# Altium project tag201TestFixture.PrjPCB
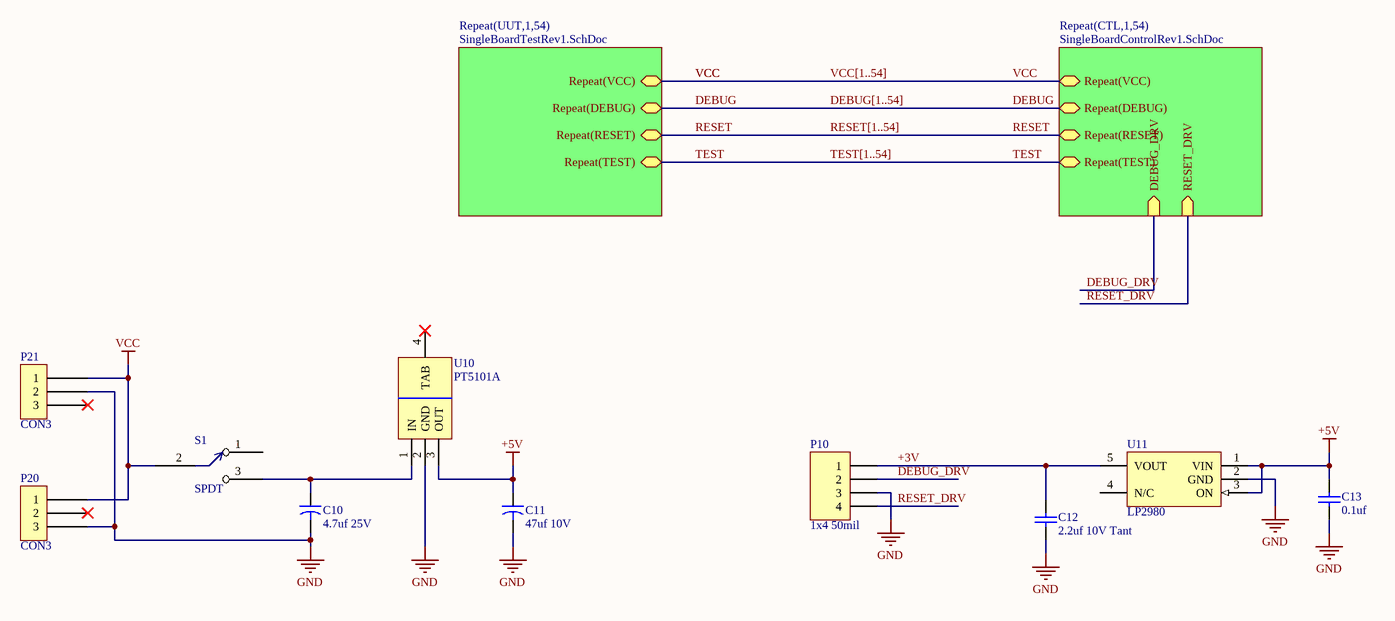
[diagram p0: Tag201_GangProgrammerColumnRev1.SchDoc]
3 sheets, 874 parts. Net scope: hierarchical (ports join the sheet entries above them; power ports are global).
Board file: Tag201_GangProgrammerRev1.PcbDoc
Sheets:
  Tag201_GangProgrammerColumnRev1.SchDoc
    UUT1 = SingleBoardTestRev1.SchDoc
    UUT2 = SingleBoardTestRev1.SchDoc
    UUT3 = SingleBoardTestRev1.SchDoc
    UUT4 = SingleBoardTestRev1.SchDoc
    UUT5 = SingleBoardTestRev1.SchDoc
    UUT6 = SingleBoardTestRev1.SchDoc
    UUT7 = SingleBoardTestRev1.SchDoc
    UUT8 = SingleBoardTestRev1.SchDoc
    UUT9 = SingleBoardTestRev1.SchDoc
    UUT10 = SingleBoardTestRev1.SchDoc
    UUT11 = SingleBoardTestRev1.SchDoc
    UUT12 = SingleBoardTestRev1.SchDoc
    UUT13 = SingleBoardTestRev1.SchDoc
    UUT14 = SingleBoardTestRev1.SchDoc
    UUT15 = SingleBoardTestRev1.SchDoc
    UUT16 = SingleBoardTestRev1.SchDoc
    UUT17 = SingleBoardTestRev1.SchDoc
    UUT18 = SingleBoardTestRev1.SchDoc
    UUT19 = SingleBoardTestRev1.SchDoc
    UUT20 = SingleBoardTestRev1.SchDoc
    UUT21 = SingleBoardTestRev1.SchDoc
    UUT22 = SingleBoardTestRev1.SchDoc
    UUT23 = SingleBoardTestRev1.SchDoc
    UUT24 = SingleBoardTestRev1.SchDoc
    UUT25 = SingleBoardTestRev1.SchDoc
    UUT26 = SingleBoardTestRev1.SchDoc
    UUT27 = SingleBoardTestRev1.SchDoc
    UUT28 = SingleBoardTestRev1.SchDoc
    UUT29 = SingleBoardTestRev1.SchDoc
    UUT30 = SingleBoardTestRev1.SchDoc
    UUT31 = SingleBoardTestRev1.SchDoc
    UUT32 = SingleBoardTestRev1.SchDoc
    UUT33 = SingleBoardTestRev1.SchDoc
    UUT34 = SingleBoardTestRev1.SchDoc
    UUT35 = SingleBoardTestRev1.SchDoc
    UUT36 = SingleBoardTestRev1.SchDoc
    UUT37 = SingleBoardTestRev1.SchDoc
    UUT38 = SingleBoardTestRev1.SchDoc
    UUT39 = SingleBoardTestRev1.SchDoc
    UUT40 = SingleBoardTestRev1.SchDoc
    UUT41 = SingleBoardTestRev1.SchDoc
    UUT42 = SingleBoardTestRev1.SchDoc
    UUT43 = SingleBoardTestRev1.SchDoc
    UUT44 = SingleBoardTestRev1.SchDoc
    UUT45 = SingleBoardTestRev1.SchDoc
    UUT46 = SingleBoardTestRev1.SchDoc
    UUT47 = SingleBoardTestRev1.SchDoc
    UUT48 = SingleBoardTestRev1.SchDoc
    UUT49 = SingleBoardTestRev1.SchDoc
    UUT50 = SingleBoardTestRev1.SchDoc
    UUT51 = SingleBoardTestRev1.SchDoc
    UUT52 = SingleBoardTestRev1.SchDoc
    UUT53 = SingleBoardTestRev1.SchDoc
    UUT54 = SingleBoardTestRev1.SchDoc
    CTL1 = SingleBoardControlRev1.SchDoc
    CTL2 = SingleBoardControlRev1.SchDoc
    CTL3 = SingleBoardControlRev1.SchDoc
    CTL4 = SingleBoardControlRev1.SchDoc
    CTL5 = SingleBoardControlRev1.SchDoc
    CTL6 = SingleBoardControlRev1.SchDoc
    CTL7 = SingleBoardControlRev1.SchDoc
    CTL8 = SingleBoardControlRev1.SchDoc
    CTL9 = SingleBoardControlRev1.SchDoc
    CTL10 = SingleBoardControlRev1.SchDoc
    CTL11 = SingleBoardControlRev1.SchDoc
    CTL12 = SingleBoardControlRev1.SchDoc
    CTL13 = SingleBoardControlRev1.SchDoc
    CTL14 = SingleBoardControlRev1.SchDoc
    CTL15 = SingleBoardControlRev1.SchDoc
    CTL16 = SingleBoardControlRev1.SchDoc
    CTL17 = SingleBoardControlRev1.SchDoc
    CTL18 = SingleBoardControlRev1.SchDoc
    CTL19 = SingleBoardControlRev1.SchDoc
    CTL20 = SingleBoardControlRev1.SchDoc
    CTL21 = SingleBoardControlRev1.SchDoc
    CTL22 = SingleBoardControlRev1.SchDoc
    CTL23 = SingleBoardControlRev1.SchDoc
    CTL24 = SingleBoardControlRev1.SchDoc
    CTL25 = SingleBoardControlRev1.SchDoc
    CTL26 = SingleBoardControlRev1.SchDoc
    CTL27 = SingleBoardControlRev1.SchDoc
    CTL28 = SingleBoardControlRev1.SchDoc
    CTL29 = SingleBoardControlRev1.SchDoc
    CTL30 = SingleBoardControlRev1.SchDoc
    CTL31 = SingleBoardControlRev1.SchDoc
    CTL32 = SingleBoardControlRev1.SchDoc
    CTL33 = SingleBoardControlRev1.SchDoc
    CTL34 = SingleBoardControlRev1.SchDoc
    CTL35 = SingleBoardControlRev1.SchDoc
    CTL36 = SingleBoardControlRev1.SchDoc
    CTL37 = SingleBoardControlRev1.SchDoc
    CTL38 = SingleBoardControlRev1.SchDoc
    CTL39 = SingleBoardControlRev1.SchDoc
    CTL40 = SingleBoardControlRev1.SchDoc
    CTL41 = SingleBoardControlRev1.SchDoc
    CTL42 = SingleBoardControlRev1.SchDoc
    CTL43 = SingleBoardControlRev1.SchDoc
    CTL44 = SingleBoardControlRev1.SchDoc
    CTL45 = SingleBoardControlRev1.SchDoc
    CTL46 = SingleBoardControlRev1.SchDoc
    CTL47 = SingleBoardControlRev1.SchDoc
    CTL48 = SingleBoardControlRev1.SchDoc
    CTL49 = SingleBoardControlRev1.SchDoc
    CTL50 = SingleBoardControlRev1.SchDoc
    CTL51 = SingleBoardControlRev1.SchDoc
    CTL52 = SingleBoardControlRev1.SchDoc
    CTL53 = SingleBoardControlRev1.SchDoc
    CTL54 = SingleBoardControlRev1.SchDoc

## Sheet Tag201_GangProgrammerColumnRev1.SchDoc
size B; Date: 2/10/2009; ApprovedBy: Touraj; DrawnBy: Juan A. Nadal; Engineer: Touraj; Organization: ActiveWave; Address1: 902 Clint Moore Rd., Suite 118; Address2: Boca Raton; Address3: FL, 33487; Address4: 561-999-9422; DocumentNumber: 3; Revision: 21; SheetNumber: 3; SheetTotal: 4; PageSetup: Record=PageOptions|CenterHorizontal=True|CenterVertical=True|PrintScale=0.70|XCorrection=1.00|YCorrection=1.00|PrintKind=0|BorderSize=5000000|LeftOffset=0|BottomOffset=0|Orientation=2|PaperLength=1000|PaperWidth=1000|Scale=100|PaperSource=7|PrintQuality=-4|MediaType=1|DitherType=10|PaperKind=Letter|PrintScaleMode=1; Project: Tag105

### Parts
C10  4.7uf 25V  [CAP C CASE_041412]
C11  47uf 10V  [CAP D CASE_030205]
C12  2.2uf 10V Tant  [CAP A CASE_030205]
C13  0.1uf  [0603_072205]
P10  1x4 50mil  [1X4 HEADER_50mil_071411]
P20  CON3  [POWER JACK_SMALLHOLE_022110]
P21  CON3  [Power Jack_SMT_071312]
S1  SPDT  [CnK_TseriesSPDT_Toggle_040512]
U10  PT5101A  [TI_PowerTrendsPT_061812]
U11  LP2980  [SOT25_030205]

### Sub-sheets
Repeat(CTL,1,54) = SingleBoardControlRev1.SchDoc: Repeat(VCC), Repeat(DEBUG), Repeat(RESET), Repeat(TEST), DEBUG_DRV (in), RESET_DRV (in)
Repeat(UUT,1,54) = SingleBoardTestRev1.SchDoc: Repeat(VCC), Repeat(DEBUG), Repeat(RESET), Repeat(TEST)

### Nets
+5V: C11.1 C13.1 U10.3(OUT) U11.1(VIN) U11.3(ON)
GND: C10.2 C11.2 C12.2 C13.2 P10.3 P20.3 P21.2 U10.2(GND) U11.2(GND)
VCC: P20.1 P21.1 S1.2 ; sheet Repeat(UUT,1,54)/Repeat(VCC), sheet Repeat(CTL,1,54)/Repeat(VCC)
+3V: C12.1 P10.1 U11.5(VOUT)
DEBUG: sheet Repeat(UUT,1,54)/Repeat(DEBUG), sheet Repeat(CTL,1,54)/Repeat(DEBUG)
DEBUG_DRV: P10.2 ; sheet Repeat(CTL,1,54)/DEBUG_DRV
RESET: sheet Repeat(UUT,1,54)/Repeat(RESET), sheet Repeat(CTL,1,54)/Repeat(RESET)
RESET_DRV: P10.4 ; sheet Repeat(CTL,1,54)/RESET_DRV
TEST: sheet Repeat(UUT,1,54)/Repeat(TEST), sheet Repeat(CTL,1,54)/Repeat(TEST)
NetC10_1: C10.1 S1.3 U10.1(IN)

Not connected (* = marked no-connect by the designer): P20 2*; P21 3*; S1 1; U10 4(TAB)*; U11 4(N/C)

### Buses and harness runs
bus DEBUG[1..54]
bus RESET[1..54]
bus TEST[1..54]
bus VCC[1..54]

### Notes on the sheet
- APPROVALS
- DATE
- Title:
- Drawn:
- Checked:
- Release:
- Date:
- Size:
- Sheet Name:
- B
- Number:
- Time:
- Revision:
- Sheet
- of
- File:

### Library data of the parts
C10 = Cap2: Capacitor; PARTNO: T491A475M025AT; MAN: Kemet; VALUE: 4.7uf 25V; DK: 399-4630-1-ND
C11 = Cap2: Capacitor; PARTNO: TAJC476K010RNJ; MAN: AVX; VALUE: 47uf 10V; DK: 478-3910-1-ND
C12 = Cap: Capacitor; PARTNO: F931A225MAA; MAN: Nichicon; VALUE: 2.2uf 10V Tant; DK: 493-2356-1-ND
C13 = Cap: Capacitor; PARTNO: C0603C104Z3VACTU; MAN: Kemet; VALUE: 0.1uf; DK: 399-1100-2-ND
P10 = Header 4: Header, 4-Pin; VALUE: 1x4 50mil; DK: 1x4 Header 0.5mil
P20 = CON3: PARTNO: PJ-102A; VALUE: POWER JACK; MAN: CUI; DK: CP-102A-ND
P21 = CON3: PARTNO: PJ-002A-SMT; VALUE: POWER JACK; MAN: CUI; DK: 002APJTR-ND
S1 = SWITCH SPST: PARTNO: T102SHCQE; MAN: C&K; VALUE: SPDT; DK: CKN10151-ND
U10 = LM340T: MAN: PowerTrends; VALUE: PT5101A; DK: PT5101A-ND; PARTNO: PT5101A
U11 = LP2985: PARTNO: LP2980AIM5-3.3/NOPB; MAN: TI / National; VALUE: LP2980; DK: LP2980AIM5-3.3CT-ND

## Sheet SingleBoardTestRev1.SchDoc
size A
Used 54 times, as channels UUT1, UUT2, UUT3, UUT4, UUT5, UUT6, UUT7, UUT8, UUT9, UUT10, UUT11, UUT12, UUT13, UUT14, UUT15, UUT16, UUT17, UUT18, UUT19, UUT20, UUT21, UUT22, UUT23, UUT24, UUT25, UUT26, UUT27, UUT28, UUT29, UUT30, UUT31, UUT32, UUT33, UUT34, UUT35, UUT36, UUT37, UUT38, UUT39, UUT40, UUT41, UUT42, UUT43, UUT44, UUT45, UUT46, UUT47, UUT48, UUT49, UUT50, UUT51, UUT52, UUT53, UUT54. Parts and nets are listed once, with the designators drawn on the sheet.
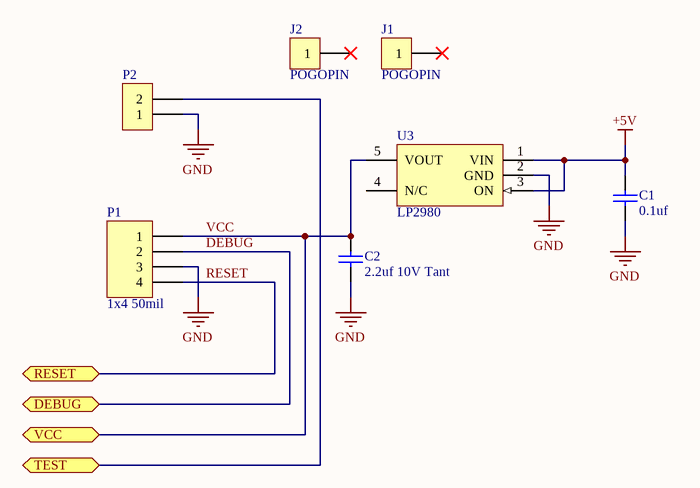
[diagram p1: SingleBoardTestRev1.SchDoc]

### Parts
C1  0.1uf  [0603_072205]
C2  2.2uf 10V Tant  [CAP A CASE_030205]
J1  POGOPIN  [TestPoint52x32]
J2  POGOPIN  [TestPoint52x32]
P1  1x4 50mil  [1X4 HEADER_50mil_071411]
P2  1x2 50mil  [1X2 HEADER_50MIL_081611]  (value not drawn)
U3  LP2980  [SOT25_030205]

### Ports
DEBUG, RESET, TEST, VCC

### Nets
+5V: C1.1 U3.1(VIN) U3.3(ON)
GND: C1.2 C2.2 P1.3 P2.1 U3.2(GND)
DEBUG: P1.2 ; port DEBUG
RESET: P1.4 ; port RESET
TEST: P2.2 ; port TEST
VCC: C2.1 P1.1 U3.5(VOUT) ; port VCC

Not connected (* = marked no-connect by the designer): J1 1*; J2 1*; U3 4(N/C)

### Channels
UUT1: designators end in _UUT1; ports DEBUG=DEBUG RESET=RESET TEST=TEST1 VCC=VCC
UUT2: designators end in _UUT2; ports DEBUG=DEBUG RESET=RESET TEST=TEST2 VCC=VCC
UUT3: designators end in _UUT3; ports DEBUG=DEBUG RESET=RESET TEST=TEST3 VCC=VCC
UUT4: designators end in _UUT4; ports DEBUG=DEBUG RESET=RESET TEST=TEST4 VCC=VCC
UUT5: designators end in _UUT5; ports DEBUG=DEBUG RESET=RESET TEST=TEST5 VCC=VCC
UUT6: designators end in _UUT6; ports DEBUG=DEBUG RESET=RESET TEST=TEST6 VCC=VCC
UUT7: designators end in _UUT7; ports DEBUG=DEBUG RESET=RESET TEST=TEST7 VCC=VCC
UUT8: designators end in _UUT8; ports DEBUG=DEBUG RESET=RESET TEST=TEST8 VCC=VCC
UUT9: designators end in _UUT9; ports DEBUG=DEBUG RESET=RESET TEST=TEST9 VCC=VCC
UUT10: designators end in _UUT10; ports DEBUG=DEBUG RESET=RESET TEST=TEST10 VCC=VCC
UUT11: designators end in _UUT11; ports DEBUG=DEBUG RESET=RESET TEST=TEST11 VCC=VCC
UUT12: designators end in _UUT12; ports DEBUG=DEBUG RESET=RESET TEST=TEST12 VCC=VCC
UUT13: designators end in _UUT13; ports DEBUG=DEBUG RESET=RESET TEST=TEST13 VCC=VCC
UUT14: designators end in _UUT14; ports DEBUG=DEBUG RESET=RESET TEST=TEST14 VCC=VCC
UUT15: designators end in _UUT15; ports DEBUG=DEBUG RESET=RESET TEST=TEST15 VCC=VCC
UUT16: designators end in _UUT16; ports DEBUG=DEBUG RESET=RESET TEST=TEST16 VCC=VCC
UUT17: designators end in _UUT17; ports DEBUG=DEBUG RESET=RESET TEST=TEST17 VCC=VCC
UUT18: designators end in _UUT18; ports DEBUG=DEBUG RESET=RESET TEST=TEST18 VCC=VCC
UUT19: designators end in _UUT19; ports DEBUG=DEBUG RESET=RESET TEST=TEST19 VCC=VCC
UUT20: designators end in _UUT20; ports DEBUG=DEBUG RESET=RESET TEST=TEST20 VCC=VCC
UUT21: designators end in _UUT21; ports DEBUG=DEBUG RESET=RESET TEST=TEST21 VCC=VCC
UUT22: designators end in _UUT22; ports DEBUG=DEBUG RESET=RESET TEST=TEST22 VCC=VCC
UUT23: designators end in _UUT23; ports DEBUG=DEBUG RESET=RESET TEST=TEST23 VCC=VCC
UUT24: designators end in _UUT24; ports DEBUG=DEBUG RESET=RESET TEST=TEST24 VCC=VCC
UUT25: designators end in _UUT25; ports DEBUG=DEBUG RESET=RESET TEST=TEST25 VCC=VCC
UUT26: designators end in _UUT26; ports DEBUG=DEBUG RESET=RESET TEST=TEST26 VCC=VCC
UUT27: designators end in _UUT27; ports DEBUG=DEBUG RESET=RESET TEST=TEST27 VCC=VCC
UUT28: designators end in _UUT28; ports DEBUG=DEBUG RESET=RESET TEST=TEST28 VCC=VCC
UUT29: designators end in _UUT29; ports DEBUG=DEBUG RESET=RESET TEST=TEST29 VCC=VCC
UUT30: designators end in _UUT30; ports DEBUG=DEBUG RESET=RESET TEST=TEST30 VCC=VCC
UUT31: designators end in _UUT31; ports DEBUG=DEBUG RESET=RESET TEST=TEST31 VCC=VCC
UUT32: designators end in _UUT32; ports DEBUG=DEBUG RESET=RESET TEST=TEST32 VCC=VCC
UUT33: designators end in _UUT33; ports DEBUG=DEBUG RESET=RESET TEST=TEST33 VCC=VCC
UUT34: designators end in _UUT34; ports DEBUG=DEBUG RESET=RESET TEST=TEST34 VCC=VCC
UUT35: designators end in _UUT35; ports DEBUG=DEBUG RESET=RESET TEST=TEST35 VCC=VCC
UUT36: designators end in _UUT36; ports DEBUG=DEBUG RESET=RESET TEST=TEST36 VCC=VCC
UUT37: designators end in _UUT37; ports DEBUG=DEBUG RESET=RESET TEST=TEST37 VCC=VCC
UUT38: designators end in _UUT38; ports DEBUG=DEBUG RESET=RESET TEST=TEST38 VCC=VCC
UUT39: designators end in _UUT39; ports DEBUG=DEBUG RESET=RESET TEST=TEST39 VCC=VCC
UUT40: designators end in _UUT40; ports DEBUG=DEBUG RESET=RESET TEST=TEST40 VCC=VCC
UUT41: designators end in _UUT41; ports DEBUG=DEBUG RESET=RESET TEST=TEST41 VCC=VCC
UUT42: designators end in _UUT42; ports DEBUG=DEBUG RESET=RESET TEST=TEST42 VCC=VCC
UUT43: designators end in _UUT43; ports DEBUG=DEBUG RESET=RESET TEST=TEST43 VCC=VCC
UUT44: designators end in _UUT44; ports DEBUG=DEBUG RESET=RESET TEST=TEST44 VCC=VCC
UUT45: designators end in _UUT45; ports DEBUG=DEBUG RESET=RESET TEST=TEST45 VCC=VCC
UUT46: designators end in _UUT46; ports DEBUG=DEBUG RESET=RESET TEST=TEST46 VCC=VCC
UUT47: designators end in _UUT47; ports DEBUG=DEBUG RESET=RESET TEST=TEST47 VCC=VCC
UUT48: designators end in _UUT48; ports DEBUG=DEBUG RESET=RESET TEST=TEST48 VCC=VCC
UUT49: designators end in _UUT49; ports DEBUG=DEBUG RESET=RESET TEST=TEST49 VCC=VCC
UUT50: designators end in _UUT50; ports DEBUG=DEBUG RESET=RESET TEST=TEST50 VCC=VCC
UUT51: designators end in _UUT51; ports DEBUG=DEBUG RESET=RESET TEST=TEST51 VCC=VCC
UUT52: designators end in _UUT52; ports DEBUG=DEBUG RESET=RESET TEST=TEST52 VCC=VCC
UUT53: designators end in _UUT53; ports DEBUG=DEBUG RESET=RESET TEST=TEST53 VCC=VCC
UUT54: designators end in _UUT54; ports DEBUG=DEBUG RESET=RESET TEST=TEST54 VCC=VCC

### Library data of the parts
C1 = Cap: as C13 on sheet Tag201_GangProgrammerColumnRev1; VALUE: 0.1uf; DK: 399-1100-2-ND
C2 = Cap: as C12 on sheet Tag201_GangProgrammerColumnRev1; VALUE: 2.2uf 10V Tant; DK: 493-2356-1-ND
J1 J2 = CON1: Connector; VALUE: POGOPIN; DK: N/A; MAN: N/A; PARTNO: N/A
P1 = Header 4: Header, 4-Pin; VALUE: 1x4 50mil; DK: 4 PogoPins
P2 = CON2: DK: 2 PogoPins; VALUE: 1x2 50mil
U3 = LP2985: as U11 on sheet Tag201_GangProgrammerColumnRev1; VALUE: LP2980; DK: LP2980AIM5-3.3CT-ND

## Sheet SingleBoardControlRev1.SchDoc
size A
Used 54 times, as channels CTL1, CTL2, CTL3, CTL4, CTL5, CTL6, CTL7, CTL8, CTL9, CTL10, CTL11, CTL12, CTL13, CTL14, CTL15, CTL16, CTL17, CTL18, CTL19, CTL20, CTL21, CTL22, CTL23, CTL24, CTL25, CTL26, CTL27, CTL28, CTL29, CTL30, CTL31, CTL32, CTL33, CTL34, CTL35, CTL36, CTL37, CTL38, CTL39, CTL40, CTL41, CTL42, CTL43, CTL44, CTL45, CTL46, CTL47, CTL48, CTL49, CTL50, CTL51, CTL52, CTL53, CTL54. Parts and nets are listed once, with the designators drawn on the sheet.
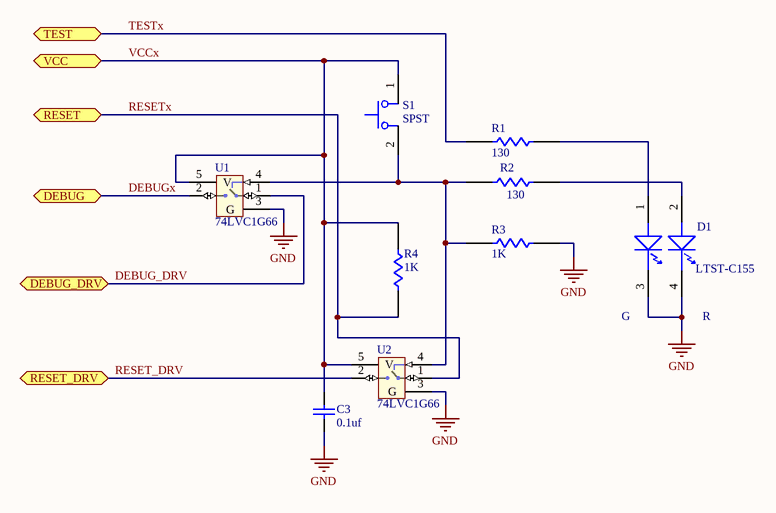
[diagram p2: SingleBoardControlRev1.SchDoc]

### Parts
C3  0.1uf  [0603_072205]
D1  LTST-C155  [LED 5mm x 2.5mm_061112]
R1  130  [0603_072205]
R2  130  [0603_072205]
R3  1K  [0603_072205]
R4  1K  [0603_072205]
S1  SPST  [SwitchDPDT_6_061412]
U1  74LVC1G66  [SOT25_030205]
U2  74LVC1G66  [SOT25_030205]

### Ports
DEBUG (bidir), DEBUG_DRV (bidir), RESET (bidir), RESET_DRV (bidir), TEST, VCC

### Nets
GND: C3.2 D1.3(K) D1.4(K) R3.2 U1.3(G) U2.3(G)
DEBUG_DRV: U1.1(INA) ; port DEBUG_DRV
DEBUGx: U1.2(OUTY) ; port DEBUG
RESET_DRV: U2.2(OUTY) ; port RESET_DRV
RESETx: R4.2 U2.1(INA) ; port RESET
TESTx: R1.2 ; port TEST
VCCx: C3.1 R4.1 S1.1 U1.5(V) U2.5(V) ; port VCC
NetD1_1: D1.1(G) R1.1
NetD1_2: D1.2(R) R2.1
NetR2_2: R2.2 R3.1 S1.2 U1.4(EN) U2.4(EN)

### Channels
CTL1: designators end in _CTL1; ports DEBUG=DEBUG DEBUG_DRV=DEBUG_DRV RESET=RESET RESET_DRV=RESET_DRV TEST=TEST1 VCC=VCC
CTL2: designators end in _CTL2; ports DEBUG=DEBUG DEBUG_DRV=DEBUG_DRV RESET=RESET RESET_DRV=RESET_DRV TEST=TEST2 VCC=VCC
CTL3: designators end in _CTL3; ports DEBUG=DEBUG DEBUG_DRV=DEBUG_DRV RESET=RESET RESET_DRV=RESET_DRV TEST=TEST3 VCC=VCC
CTL4: designators end in _CTL4; ports DEBUG=DEBUG DEBUG_DRV=DEBUG_DRV RESET=RESET RESET_DRV=RESET_DRV TEST=TEST4 VCC=VCC
CTL5: designators end in _CTL5; ports DEBUG=DEBUG DEBUG_DRV=DEBUG_DRV RESET=RESET RESET_DRV=RESET_DRV TEST=TEST5 VCC=VCC
CTL6: designators end in _CTL6; ports DEBUG=DEBUG DEBUG_DRV=DEBUG_DRV RESET=RESET RESET_DRV=RESET_DRV TEST=TEST6 VCC=VCC
CTL7: designators end in _CTL7; ports DEBUG=DEBUG DEBUG_DRV=DEBUG_DRV RESET=RESET RESET_DRV=RESET_DRV TEST=TEST7 VCC=VCC
CTL8: designators end in _CTL8; ports DEBUG=DEBUG DEBUG_DRV=DEBUG_DRV RESET=RESET RESET_DRV=RESET_DRV TEST=TEST8 VCC=VCC
CTL9: designators end in _CTL9; ports DEBUG=DEBUG DEBUG_DRV=DEBUG_DRV RESET=RESET RESET_DRV=RESET_DRV TEST=TEST9 VCC=VCC
CTL10: designators end in _CTL10; ports DEBUG=DEBUG DEBUG_DRV=DEBUG_DRV RESET=RESET RESET_DRV=RESET_DRV TEST=TEST10 VCC=VCC
CTL11: designators end in _CTL11; ports DEBUG=DEBUG DEBUG_DRV=DEBUG_DRV RESET=RESET RESET_DRV=RESET_DRV TEST=TEST11 VCC=VCC
CTL12: designators end in _CTL12; ports DEBUG=DEBUG DEBUG_DRV=DEBUG_DRV RESET=RESET RESET_DRV=RESET_DRV TEST=TEST12 VCC=VCC
CTL13: designators end in _CTL13; ports DEBUG=DEBUG DEBUG_DRV=DEBUG_DRV RESET=RESET RESET_DRV=RESET_DRV TEST=TEST13 VCC=VCC
CTL14: designators end in _CTL14; ports DEBUG=DEBUG DEBUG_DRV=DEBUG_DRV RESET=RESET RESET_DRV=RESET_DRV TEST=TEST14 VCC=VCC
CTL15: designators end in _CTL15; ports DEBUG=DEBUG DEBUG_DRV=DEBUG_DRV RESET=RESET RESET_DRV=RESET_DRV TEST=TEST15 VCC=VCC
CTL16: designators end in _CTL16; ports DEBUG=DEBUG DEBUG_DRV=DEBUG_DRV RESET=RESET RESET_DRV=RESET_DRV TEST=TEST16 VCC=VCC
CTL17: designators end in _CTL17; ports DEBUG=DEBUG DEBUG_DRV=DEBUG_DRV RESET=RESET RESET_DRV=RESET_DRV TEST=TEST17 VCC=VCC
CTL18: designators end in _CTL18; ports DEBUG=DEBUG DEBUG_DRV=DEBUG_DRV RESET=RESET RESET_DRV=RESET_DRV TEST=TEST18 VCC=VCC
CTL19: designators end in _CTL19; ports DEBUG=DEBUG DEBUG_DRV=DEBUG_DRV RESET=RESET RESET_DRV=RESET_DRV TEST=TEST19 VCC=VCC
CTL20: designators end in _CTL20; ports DEBUG=DEBUG DEBUG_DRV=DEBUG_DRV RESET=RESET RESET_DRV=RESET_DRV TEST=TEST20 VCC=VCC
CTL21: designators end in _CTL21; ports DEBUG=DEBUG DEBUG_DRV=DEBUG_DRV RESET=RESET RESET_DRV=RESET_DRV TEST=TEST21 VCC=VCC
CTL22: designators end in _CTL22; ports DEBUG=DEBUG DEBUG_DRV=DEBUG_DRV RESET=RESET RESET_DRV=RESET_DRV TEST=TEST22 VCC=VCC
CTL23: designators end in _CTL23; ports DEBUG=DEBUG DEBUG_DRV=DEBUG_DRV RESET=RESET RESET_DRV=RESET_DRV TEST=TEST23 VCC=VCC
CTL24: designators end in _CTL24; ports DEBUG=DEBUG DEBUG_DRV=DEBUG_DRV RESET=RESET RESET_DRV=RESET_DRV TEST=TEST24 VCC=VCC
CTL25: designators end in _CTL25; ports DEBUG=DEBUG DEBUG_DRV=DEBUG_DRV RESET=RESET RESET_DRV=RESET_DRV TEST=TEST25 VCC=VCC
CTL26: designators end in _CTL26; ports DEBUG=DEBUG DEBUG_DRV=DEBUG_DRV RESET=RESET RESET_DRV=RESET_DRV TEST=TEST26 VCC=VCC
CTL27: designators end in _CTL27; ports DEBUG=DEBUG DEBUG_DRV=DEBUG_DRV RESET=RESET RESET_DRV=RESET_DRV TEST=TEST27 VCC=VCC
CTL28: designators end in _CTL28; ports DEBUG=DEBUG DEBUG_DRV=DEBUG_DRV RESET=RESET RESET_DRV=RESET_DRV TEST=TEST28 VCC=VCC
CTL29: designators end in _CTL29; ports DEBUG=DEBUG DEBUG_DRV=DEBUG_DRV RESET=RESET RESET_DRV=RESET_DRV TEST=TEST29 VCC=VCC
CTL30: designators end in _CTL30; ports DEBUG=DEBUG DEBUG_DRV=DEBUG_DRV RESET=RESET RESET_DRV=RESET_DRV TEST=TEST30 VCC=VCC
CTL31: designators end in _CTL31; ports DEBUG=DEBUG DEBUG_DRV=DEBUG_DRV RESET=RESET RESET_DRV=RESET_DRV TEST=TEST31 VCC=VCC
CTL32: designators end in _CTL32; ports DEBUG=DEBUG DEBUG_DRV=DEBUG_DRV RESET=RESET RESET_DRV=RESET_DRV TEST=TEST32 VCC=VCC
CTL33: designators end in _CTL33; ports DEBUG=DEBUG DEBUG_DRV=DEBUG_DRV RESET=RESET RESET_DRV=RESET_DRV TEST=TEST33 VCC=VCC
CTL34: designators end in _CTL34; ports DEBUG=DEBUG DEBUG_DRV=DEBUG_DRV RESET=RESET RESET_DRV=RESET_DRV TEST=TEST34 VCC=VCC
CTL35: designators end in _CTL35; ports DEBUG=DEBUG DEBUG_DRV=DEBUG_DRV RESET=RESET RESET_DRV=RESET_DRV TEST=TEST35 VCC=VCC
CTL36: designators end in _CTL36; ports DEBUG=DEBUG DEBUG_DRV=DEBUG_DRV RESET=RESET RESET_DRV=RESET_DRV TEST=TEST36 VCC=VCC
CTL37: designators end in _CTL37; ports DEBUG=DEBUG DEBUG_DRV=DEBUG_DRV RESET=RESET RESET_DRV=RESET_DRV TEST=TEST37 VCC=VCC
CTL38: designators end in _CTL38; ports DEBUG=DEBUG DEBUG_DRV=DEBUG_DRV RESET=RESET RESET_DRV=RESET_DRV TEST=TEST38 VCC=VCC
CTL39: designators end in _CTL39; ports DEBUG=DEBUG DEBUG_DRV=DEBUG_DRV RESET=RESET RESET_DRV=RESET_DRV TEST=TEST39 VCC=VCC
CTL40: designators end in _CTL40; ports DEBUG=DEBUG DEBUG_DRV=DEBUG_DRV RESET=RESET RESET_DRV=RESET_DRV TEST=TEST40 VCC=VCC
CTL41: designators end in _CTL41; ports DEBUG=DEBUG DEBUG_DRV=DEBUG_DRV RESET=RESET RESET_DRV=RESET_DRV TEST=TEST41 VCC=VCC
CTL42: designators end in _CTL42; ports DEBUG=DEBUG DEBUG_DRV=DEBUG_DRV RESET=RESET RESET_DRV=RESET_DRV TEST=TEST42 VCC=VCC
CTL43: designators end in _CTL43; ports DEBUG=DEBUG DEBUG_DRV=DEBUG_DRV RESET=RESET RESET_DRV=RESET_DRV TEST=TEST43 VCC=VCC
CTL44: designators end in _CTL44; ports DEBUG=DEBUG DEBUG_DRV=DEBUG_DRV RESET=RESET RESET_DRV=RESET_DRV TEST=TEST44 VCC=VCC
CTL45: designators end in _CTL45; ports DEBUG=DEBUG DEBUG_DRV=DEBUG_DRV RESET=RESET RESET_DRV=RESET_DRV TEST=TEST45 VCC=VCC
CTL46: designators end in _CTL46; ports DEBUG=DEBUG DEBUG_DRV=DEBUG_DRV RESET=RESET RESET_DRV=RESET_DRV TEST=TEST46 VCC=VCC
CTL47: designators end in _CTL47; ports DEBUG=DEBUG DEBUG_DRV=DEBUG_DRV RESET=RESET RESET_DRV=RESET_DRV TEST=TEST47 VCC=VCC
CTL48: designators end in _CTL48; ports DEBUG=DEBUG DEBUG_DRV=DEBUG_DRV RESET=RESET RESET_DRV=RESET_DRV TEST=TEST48 VCC=VCC
CTL49: designators end in _CTL49; ports DEBUG=DEBUG DEBUG_DRV=DEBUG_DRV RESET=RESET RESET_DRV=RESET_DRV TEST=TEST49 VCC=VCC
CTL50: designators end in _CTL50; ports DEBUG=DEBUG DEBUG_DRV=DEBUG_DRV RESET=RESET RESET_DRV=RESET_DRV TEST=TEST50 VCC=VCC
CTL51: designators end in _CTL51; ports DEBUG=DEBUG DEBUG_DRV=DEBUG_DRV RESET=RESET RESET_DRV=RESET_DRV TEST=TEST51 VCC=VCC
CTL52: designators end in _CTL52; ports DEBUG=DEBUG DEBUG_DRV=DEBUG_DRV RESET=RESET RESET_DRV=RESET_DRV TEST=TEST52 VCC=VCC
CTL53: designators end in _CTL53; ports DEBUG=DEBUG DEBUG_DRV=DEBUG_DRV RESET=RESET RESET_DRV=RESET_DRV TEST=TEST53 VCC=VCC
CTL54: designators end in _CTL54; ports DEBUG=DEBUG DEBUG_DRV=DEBUG_DRV RESET=RESET RESET_DRV=RESET_DRV TEST=TEST54 VCC=VCC

### Notes on the sheet
- (near D1) G
- (near D1) R

### Library data of the parts
C3 = Cap: as C13 on sheet Tag201_GangProgrammerColumnRev1; VALUE: 0.1uf; DK: 399-1100-2-ND
D1 = LED_BI_2_1: PARTNO: LTST-C155GEKT; VALUE: LTST-C155; DK: 160-1172-2-ND
R1 R2 = RESISTOR: PARTNO: MCR03EZPFX1300; MAN: Rohm; VALUE: 130; DK: RHM130HTR-ND
R3 R4 = RESISTOR: PARTNO: MCR03EZPFX1001; MAN: Rohm; VALUE: 1K; DK: RHM1.00KHTR-ND
S1 = SWITCH PB: PARTNO: PVA2 EE H1; VALUE: SPST; DK: 401-1140-ND
U1 U2 = 7466_SINGLE: Single Solid State Switch; PARTNO: SN74LVC1G66DBVR; VALUE: 74LVC1G66; DK: 296-13253-1-ND

## Nets that join several sheets
+5V: Tag201_GangProgrammerColumnRev1 (5 pins), UUT1 (C1_UUT1.1 U3_UUT1.1 U3_UUT1.3), UUT2 (C1_UUT2.1 U3_UUT2.1 U3_UUT2.3), UUT3 (C1_UUT3.1 U3_UUT3.1 U3_UUT3.3), UUT4 (C1_UUT4.1 U3_UUT4.1 U3_UUT4.3), UUT5 (C1_UUT5.1 U3_UUT5.1 U3_UUT5.3), UUT6 (C1_UUT6.1 U3_UUT6.1 U3_UUT6.3), UUT7 (C1_UUT7.1 U3_UUT7.1 U3_UUT7.3), UUT8 (C1_UUT8.1 U3_UUT8.1 U3_UUT8.3), UUT9 (C1_UUT9.1 U3_UUT9.1 U3_UUT9.3), UUT10 (C1_UUT10.1 U3_UUT10.1 U3_UUT10.3), UUT11 (C1_UUT11.1 U3_UUT11.1 U3_UUT11.3), UUT12 (C1_UUT12.1 U3_UUT12.1 U3_UUT12.3), UUT13 (C1_UUT13.1 U3_UUT13.1 U3_UUT13.3), UUT14 (C1_UUT14.1 U3_UUT14.1 U3_UUT14.3), UUT15 (C1_UUT15.1 U3_UUT15.1 U3_UUT15.3), UUT16 (C1_UUT16.1 U3_UUT16.1 U3_UUT16.3), UUT17 (C1_UUT17.1 U3_UUT17.1 U3_UUT17.3), UUT18 (C1_UUT18.1 U3_UUT18.1 U3_UUT18.3), UUT19 (C1_UUT19.1 U3_UUT19.1 U3_UUT19.3), UUT20 (C1_UUT20.1 U3_UUT20.1 U3_UUT20.3), UUT21 (C1_UUT21.1 U3_UUT21.1 U3_UUT21.3), UUT22 (C1_UUT22.1 U3_UUT22.1 U3_UUT22.3), UUT23 (C1_UUT23.1 U3_UUT23.1 U3_UUT23.3), UUT24 (C1_UUT24.1 U3_UUT24.1 U3_UUT24.3), UUT25 (C1_UUT25.1 U3_UUT25.1 U3_UUT25.3), UUT26 (C1_UUT26.1 U3_UUT26.1 U3_UUT26.3), UUT27 (C1_UUT27.1 U3_UUT27.1 U3_UUT27.3), UUT28 (C1_UUT28.1 U3_UUT28.1 U3_UUT28.3), UUT29 (C1_UUT29.1 U3_UUT29.1 U3_UUT29.3), UUT30 (C1_UUT30.1 U3_UUT30.1 U3_UUT30.3), UUT31 (C1_UUT31.1 U3_UUT31.1 U3_UUT31.3), UUT32 (C1_UUT32.1 U3_UUT32.1 U3_UUT32.3), UUT33 (C1_UUT33.1 U3_UUT33.1 U3_UUT33.3), UUT34 (C1_UUT34.1 U3_UUT34.1 U3_UUT34.3), UUT35 (C1_UUT35.1 U3_UUT35.1 U3_UUT35.3), UUT36 (C1_UUT36.1 U3_UUT36.1 U3_UUT36.3), UUT37 (C1_UUT37.1 U3_UUT37.1 U3_UUT37.3), UUT38 (C1_UUT38.1 U3_UUT38.1 U3_UUT38.3), UUT39 (C1_UUT39.1 U3_UUT39.1 U3_UUT39.3), UUT40 (C1_UUT40.1 U3_UUT40.1 U3_UUT40.3), UUT41 (C1_UUT41.1 U3_UUT41.1 U3_UUT41.3), UUT42 (C1_UUT42.1 U3_UUT42.1 U3_UUT42.3), UUT43 (C1_UUT43.1 U3_UUT43.1 U3_UUT43.3), UUT44 (C1_UUT44.1 U3_UUT44.1 U3_UUT44.3), UUT45 (C1_UUT45.1 U3_UUT45.1 U3_UUT45.3), UUT46 (C1_UUT46.1 U3_UUT46.1 U3_UUT46.3), UUT47 (C1_UUT47.1 U3_UUT47.1 U3_UUT47.3), UUT48 (C1_UUT48.1 U3_UUT48.1 U3_UUT48.3), UUT49 (C1_UUT49.1 U3_UUT49.1 U3_UUT49.3), UUT50 (C1_UUT50.1 U3_UUT50.1 U3_UUT50.3), UUT51 (C1_UUT51.1 U3_UUT51.1 U3_UUT51.3), UUT52 (C1_UUT52.1 U3_UUT52.1 U3_UUT52.3), UUT53 (C1_UUT53.1 U3_UUT53.1 U3_UUT53.3), UUT54 (C1_UUT54.1 U3_UUT54.1 U3_UUT54.3)
GND: Tag201_GangProgrammerColumnRev1 (9 pins), UUT1 (5 pins), UUT2 (5 pins), UUT3 (5 pins), UUT4 (5 pins), UUT5 (5 pins), UUT6 (5 pins), UUT7 (5 pins), UUT8 (5 pins), UUT9 (5 pins), UUT10 (5 pins), UUT11 (5 pins), UUT12 (5 pins), UUT13 (5 pins), UUT14 (5 pins), UUT15 (5 pins), UUT16 (5 pins), UUT17 (5 pins), UUT18 (5 pins), UUT19 (5 pins), UUT20 (5 pins), UUT21 (5 pins), UUT22 (5 pins), UUT23 (5 pins), UUT24 (5 pins), UUT25 (5 pins), UUT26 (5 pins), UUT27 (5 pins), UUT28 (5 pins), UUT29 (5 pins), UUT30 (5 pins), UUT31 (5 pins), UUT32 (5 pins), UUT33 (5 pins), UUT34 (5 pins), UUT35 (5 pins), UUT36 (5 pins), UUT37 (5 pins), UUT38 (5 pins), UUT39 (5 pins), UUT40 (5 pins), UUT41 (5 pins), UUT42 (5 pins), UUT43 (5 pins), UUT44 (5 pins), UUT45 (5 pins), UUT46 (5 pins), UUT47 (5 pins), UUT48 (5 pins), UUT49 (5 pins), UUT50 (5 pins), UUT51 (5 pins), UUT52 (5 pins), UUT53 (5 pins), UUT54 (5 pins), CTL1 (6 pins), CTL2 (6 pins), CTL3 (6 pins), CTL4 (6 pins), CTL5 (6 pins), CTL6 (6 pins), CTL7 (6 pins), CTL8 (6 pins), CTL9 (6 pins), CTL10 (6 pins), CTL11 (6 pins), CTL12 (6 pins), CTL13 (6 pins), CTL14 (6 pins), CTL15 (6 pins), CTL16 (6 pins), CTL17 (6 pins), CTL18 (6 pins), CTL19 (6 pins), CTL20 (6 pins), CTL21 (6 pins), CTL22 (6 pins), CTL23 (6 pins), CTL24 (6 pins), CTL25 (6 pins), CTL26 (6 pins), CTL27 (6 pins), CTL28 (6 pins), CTL29 (6 pins), CTL30 (6 pins), CTL31 (6 pins), CTL32 (6 pins), CTL33 (6 pins), CTL34 (6 pins), CTL35 (6 pins), CTL36 (6 pins), CTL37 (6 pins), CTL38 (6 pins), CTL39 (6 pins), CTL40 (6 pins), CTL41 (6 pins), CTL42 (6 pins), CTL43 (6 pins), CTL44 (6 pins), CTL45 (6 pins), CTL46 (6 pins), CTL47 (6 pins), CTL48 (6 pins), CTL49 (6 pins), CTL50 (6 pins), CTL51 (6 pins), CTL52 (6 pins), CTL53 (6 pins), CTL54 (6 pins)
DEBUG: UUT1 (P1_UUT1.2), CTL1 (U1_CTL1.2)
DEBUG: UUT2 (P1_UUT2.2), CTL2 (U1_CTL2.2)
DEBUG: UUT3 (P1_UUT3.2), CTL3 (U1_CTL3.2)
DEBUG: UUT4 (P1_UUT4.2), CTL4 (U1_CTL4.2)
DEBUG: UUT5 (P1_UUT5.2), CTL5 (U1_CTL5.2)
DEBUG: UUT6 (P1_UUT6.2), CTL6 (U1_CTL6.2)
DEBUG: UUT7 (P1_UUT7.2), CTL7 (U1_CTL7.2)
DEBUG: UUT8 (P1_UUT8.2), CTL8 (U1_CTL8.2)
DEBUG: UUT9 (P1_UUT9.2), CTL9 (U1_CTL9.2)
DEBUG: UUT10 (P1_UUT10.2), CTL10 (U1_CTL10.2)
DEBUG: UUT11 (P1_UUT11.2), CTL11 (U1_CTL11.2)
DEBUG: UUT12 (P1_UUT12.2), CTL12 (U1_CTL12.2)
DEBUG: UUT13 (P1_UUT13.2), CTL13 (U1_CTL13.2)
DEBUG: UUT14 (P1_UUT14.2), CTL14 (U1_CTL14.2)
DEBUG: UUT15 (P1_UUT15.2), CTL15 (U1_CTL15.2)
DEBUG: UUT16 (P1_UUT16.2), CTL16 (U1_CTL16.2)
DEBUG: UUT17 (P1_UUT17.2), CTL17 (U1_CTL17.2)
DEBUG: UUT18 (P1_UUT18.2), CTL18 (U1_CTL18.2)
DEBUG: UUT19 (P1_UUT19.2), CTL19 (U1_CTL19.2)
DEBUG: UUT20 (P1_UUT20.2), CTL20 (U1_CTL20.2)
DEBUG: UUT21 (P1_UUT21.2), CTL21 (U1_CTL21.2)
DEBUG: UUT22 (P1_UUT22.2), CTL22 (U1_CTL22.2)
DEBUG: UUT23 (P1_UUT23.2), CTL23 (U1_CTL23.2)
DEBUG: UUT24 (P1_UUT24.2), CTL24 (U1_CTL24.2)
DEBUG: UUT25 (P1_UUT25.2), CTL25 (U1_CTL25.2)
DEBUG: UUT26 (P1_UUT26.2), CTL26 (U1_CTL26.2)
DEBUG: UUT27 (P1_UUT27.2), CTL27 (U1_CTL27.2)
DEBUG: UUT28 (P1_UUT28.2), CTL28 (U1_CTL28.2)
DEBUG: UUT29 (P1_UUT29.2), CTL29 (U1_CTL29.2)
DEBUG: UUT30 (P1_UUT30.2), CTL30 (U1_CTL30.2)
DEBUG: UUT31 (P1_UUT31.2), CTL31 (U1_CTL31.2)
DEBUG: UUT32 (P1_UUT32.2), CTL32 (U1_CTL32.2)
DEBUG: UUT33 (P1_UUT33.2), CTL33 (U1_CTL33.2)
DEBUG: UUT34 (P1_UUT34.2), CTL34 (U1_CTL34.2)
DEBUG: UUT35 (P1_UUT35.2), CTL35 (U1_CTL35.2)
DEBUG: UUT36 (P1_UUT36.2), CTL36 (U1_CTL36.2)
DEBUG: UUT37 (P1_UUT37.2), CTL37 (U1_CTL37.2)
DEBUG: UUT38 (P1_UUT38.2), CTL38 (U1_CTL38.2)
DEBUG: UUT39 (P1_UUT39.2), CTL39 (U1_CTL39.2)
DEBUG: UUT40 (P1_UUT40.2), CTL40 (U1_CTL40.2)
DEBUG: UUT41 (P1_UUT41.2), CTL41 (U1_CTL41.2)
DEBUG: UUT42 (P1_UUT42.2), CTL42 (U1_CTL42.2)
DEBUG: UUT43 (P1_UUT43.2), CTL43 (U1_CTL43.2)
DEBUG: UUT44 (P1_UUT44.2), CTL44 (U1_CTL44.2)
DEBUG: UUT45 (P1_UUT45.2), CTL45 (U1_CTL45.2)
DEBUG: UUT46 (P1_UUT46.2), CTL46 (U1_CTL46.2)
DEBUG: UUT47 (P1_UUT47.2), CTL47 (U1_CTL47.2)
DEBUG: UUT48 (P1_UUT48.2), CTL48 (U1_CTL48.2)
DEBUG: UUT49 (P1_UUT49.2), CTL49 (U1_CTL49.2)
DEBUG: UUT50 (P1_UUT50.2), CTL50 (U1_CTL50.2)
DEBUG: UUT51 (P1_UUT51.2), CTL51 (U1_CTL51.2)
DEBUG: UUT52 (P1_UUT52.2), CTL52 (U1_CTL52.2)
DEBUG: UUT53 (P1_UUT53.2), CTL53 (U1_CTL53.2)
DEBUG: UUT54 (P1_UUT54.2), CTL54 (U1_CTL54.2)
DEBUG_DRV: Tag201_GangProgrammerColumnRev1 (P10.2), CTL1 (U1_CTL1.1), CTL2 (U1_CTL2.1), CTL3 (U1_CTL3.1), CTL4 (U1_CTL4.1), CTL5 (U1_CTL5.1), CTL6 (U1_CTL6.1), CTL7 (U1_CTL7.1), CTL8 (U1_CTL8.1), CTL9 (U1_CTL9.1), CTL10 (U1_CTL10.1), CTL11 (U1_CTL11.1), CTL12 (U1_CTL12.1), CTL13 (U1_CTL13.1), CTL14 (U1_CTL14.1), CTL15 (U1_CTL15.1), CTL16 (U1_CTL16.1), CTL17 (U1_CTL17.1), CTL18 (U1_CTL18.1), CTL19 (U1_CTL19.1), CTL20 (U1_CTL20.1), CTL21 (U1_CTL21.1), CTL22 (U1_CTL22.1), CTL23 (U1_CTL23.1), CTL24 (U1_CTL24.1), CTL25 (U1_CTL25.1), CTL26 (U1_CTL26.1), CTL27 (U1_CTL27.1), CTL28 (U1_CTL28.1), CTL29 (U1_CTL29.1), CTL30 (U1_CTL30.1), CTL31 (U1_CTL31.1), CTL32 (U1_CTL32.1), CTL33 (U1_CTL33.1), CTL34 (U1_CTL34.1), CTL35 (U1_CTL35.1), CTL36 (U1_CTL36.1), CTL37 (U1_CTL37.1), CTL38 (U1_CTL38.1), CTL39 (U1_CTL39.1), CTL40 (U1_CTL40.1), CTL41 (U1_CTL41.1), CTL42 (U1_CTL42.1), CTL43 (U1_CTL43.1), CTL44 (U1_CTL44.1), CTL45 (U1_CTL45.1), CTL46 (U1_CTL46.1), CTL47 (U1_CTL47.1), CTL48 (U1_CTL48.1), CTL49 (U1_CTL49.1), CTL50 (U1_CTL50.1), CTL51 (U1_CTL51.1), CTL52 (U1_CTL52.1), CTL53 (U1_CTL53.1), CTL54 (U1_CTL54.1)
RESET: UUT1 (P1_UUT1.4), CTL1 (R4_CTL1.2 U2_CTL1.1)
RESET: UUT2 (P1_UUT2.4), CTL2 (R4_CTL2.2 U2_CTL2.1)
RESET: UUT3 (P1_UUT3.4), CTL3 (R4_CTL3.2 U2_CTL3.1)
RESET: UUT4 (P1_UUT4.4), CTL4 (R4_CTL4.2 U2_CTL4.1)
RESET: UUT5 (P1_UUT5.4), CTL5 (R4_CTL5.2 U2_CTL5.1)
RESET: UUT6 (P1_UUT6.4), CTL6 (R4_CTL6.2 U2_CTL6.1)
RESET: UUT7 (P1_UUT7.4), CTL7 (R4_CTL7.2 U2_CTL7.1)
RESET: UUT8 (P1_UUT8.4), CTL8 (R4_CTL8.2 U2_CTL8.1)
RESET: UUT9 (P1_UUT9.4), CTL9 (R4_CTL9.2 U2_CTL9.1)
RESET: UUT10 (P1_UUT10.4), CTL10 (R4_CTL10.2 U2_CTL10.1)
RESET: UUT11 (P1_UUT11.4), CTL11 (R4_CTL11.2 U2_CTL11.1)
RESET: UUT12 (P1_UUT12.4), CTL12 (R4_CTL12.2 U2_CTL12.1)
RESET: UUT13 (P1_UUT13.4), CTL13 (R4_CTL13.2 U2_CTL13.1)
RESET: UUT14 (P1_UUT14.4), CTL14 (R4_CTL14.2 U2_CTL14.1)
RESET: UUT15 (P1_UUT15.4), CTL15 (R4_CTL15.2 U2_CTL15.1)
RESET: UUT16 (P1_UUT16.4), CTL16 (R4_CTL16.2 U2_CTL16.1)
RESET: UUT17 (P1_UUT17.4), CTL17 (R4_CTL17.2 U2_CTL17.1)
RESET: UUT18 (P1_UUT18.4), CTL18 (R4_CTL18.2 U2_CTL18.1)
RESET: UUT19 (P1_UUT19.4), CTL19 (R4_CTL19.2 U2_CTL19.1)
RESET: UUT20 (P1_UUT20.4), CTL20 (R4_CTL20.2 U2_CTL20.1)
RESET: UUT21 (P1_UUT21.4), CTL21 (R4_CTL21.2 U2_CTL21.1)
RESET: UUT22 (P1_UUT22.4), CTL22 (R4_CTL22.2 U2_CTL22.1)
RESET: UUT23 (P1_UUT23.4), CTL23 (R4_CTL23.2 U2_CTL23.1)
RESET: UUT24 (P1_UUT24.4), CTL24 (R4_CTL24.2 U2_CTL24.1)
RESET: UUT25 (P1_UUT25.4), CTL25 (R4_CTL25.2 U2_CTL25.1)
RESET: UUT26 (P1_UUT26.4), CTL26 (R4_CTL26.2 U2_CTL26.1)
RESET: UUT27 (P1_UUT27.4), CTL27 (R4_CTL27.2 U2_CTL27.1)
RESET: UUT28 (P1_UUT28.4), CTL28 (R4_CTL28.2 U2_CTL28.1)
RESET: UUT29 (P1_UUT29.4), CTL29 (R4_CTL29.2 U2_CTL29.1)
RESET: UUT30 (P1_UUT30.4), CTL30 (R4_CTL30.2 U2_CTL30.1)
RESET: UUT31 (P1_UUT31.4), CTL31 (R4_CTL31.2 U2_CTL31.1)
RESET: UUT32 (P1_UUT32.4), CTL32 (R4_CTL32.2 U2_CTL32.1)
RESET: UUT33 (P1_UUT33.4), CTL33 (R4_CTL33.2 U2_CTL33.1)
RESET: UUT34 (P1_UUT34.4), CTL34 (R4_CTL34.2 U2_CTL34.1)
RESET: UUT35 (P1_UUT35.4), CTL35 (R4_CTL35.2 U2_CTL35.1)
RESET: UUT36 (P1_UUT36.4), CTL36 (R4_CTL36.2 U2_CTL36.1)
RESET: UUT37 (P1_UUT37.4), CTL37 (R4_CTL37.2 U2_CTL37.1)
RESET: UUT38 (P1_UUT38.4), CTL38 (R4_CTL38.2 U2_CTL38.1)
RESET: UUT39 (P1_UUT39.4), CTL39 (R4_CTL39.2 U2_CTL39.1)
RESET: UUT40 (P1_UUT40.4), CTL40 (R4_CTL40.2 U2_CTL40.1)
RESET: UUT41 (P1_UUT41.4), CTL41 (R4_CTL41.2 U2_CTL41.1)
RESET: UUT42 (P1_UUT42.4), CTL42 (R4_CTL42.2 U2_CTL42.1)
RESET: UUT43 (P1_UUT43.4), CTL43 (R4_CTL43.2 U2_CTL43.1)
RESET: UUT44 (P1_UUT44.4), CTL44 (R4_CTL44.2 U2_CTL44.1)
RESET: UUT45 (P1_UUT45.4), CTL45 (R4_CTL45.2 U2_CTL45.1)
RESET: UUT46 (P1_UUT46.4), CTL46 (R4_CTL46.2 U2_CTL46.1)
RESET: UUT47 (P1_UUT47.4), CTL47 (R4_CTL47.2 U2_CTL47.1)
RESET: UUT48 (P1_UUT48.4), CTL48 (R4_CTL48.2 U2_CTL48.1)
RESET: UUT49 (P1_UUT49.4), CTL49 (R4_CTL49.2 U2_CTL49.1)
RESET: UUT50 (P1_UUT50.4), CTL50 (R4_CTL50.2 U2_CTL50.1)
RESET: UUT51 (P1_UUT51.4), CTL51 (R4_CTL51.2 U2_CTL51.1)
RESET: UUT52 (P1_UUT52.4), CTL52 (R4_CTL52.2 U2_CTL52.1)
RESET: UUT53 (P1_UUT53.4), CTL53 (R4_CTL53.2 U2_CTL53.1)
RESET: UUT54 (P1_UUT54.4), CTL54 (R4_CTL54.2 U2_CTL54.1)
RESET_DRV: Tag201_GangProgrammerColumnRev1 (P10.4), CTL1 (U2_CTL1.2), CTL2 (U2_CTL2.2), CTL3 (U2_CTL3.2), CTL4 (U2_CTL4.2), CTL5 (U2_CTL5.2), CTL6 (U2_CTL6.2), CTL7 (U2_CTL7.2), CTL8 (U2_CTL8.2), CTL9 (U2_CTL9.2), CTL10 (U2_CTL10.2), CTL11 (U2_CTL11.2), CTL12 (U2_CTL12.2), CTL13 (U2_CTL13.2), CTL14 (U2_CTL14.2), CTL15 (U2_CTL15.2), CTL16 (U2_CTL16.2), CTL17 (U2_CTL17.2), CTL18 (U2_CTL18.2), CTL19 (U2_CTL19.2), CTL20 (U2_CTL20.2), CTL21 (U2_CTL21.2), CTL22 (U2_CTL22.2), CTL23 (U2_CTL23.2), CTL24 (U2_CTL24.2), CTL25 (U2_CTL25.2), CTL26 (U2_CTL26.2), CTL27 (U2_CTL27.2), CTL28 (U2_CTL28.2), CTL29 (U2_CTL29.2), CTL30 (U2_CTL30.2), CTL31 (U2_CTL31.2), CTL32 (U2_CTL32.2), CTL33 (U2_CTL33.2), CTL34 (U2_CTL34.2), CTL35 (U2_CTL35.2), CTL36 (U2_CTL36.2), CTL37 (U2_CTL37.2), CTL38 (U2_CTL38.2), CTL39 (U2_CTL39.2), CTL40 (U2_CTL40.2), CTL41 (U2_CTL41.2), CTL42 (U2_CTL42.2), CTL43 (U2_CTL43.2), CTL44 (U2_CTL44.2), CTL45 (U2_CTL45.2), CTL46 (U2_CTL46.2), CTL47 (U2_CTL47.2), CTL48 (U2_CTL48.2), CTL49 (U2_CTL49.2), CTL50 (U2_CTL50.2), CTL51 (U2_CTL51.2), CTL52 (U2_CTL52.2), CTL53 (U2_CTL53.2), CTL54 (U2_CTL54.2)
TEST1: UUT1 (P2_UUT1.2), CTL1 (R1_CTL1.2)
TEST2: UUT2 (P2_UUT2.2), CTL2 (R1_CTL2.2)
TEST3: UUT3 (P2_UUT3.2), CTL3 (R1_CTL3.2)
TEST4: UUT4 (P2_UUT4.2), CTL4 (R1_CTL4.2)
TEST5: UUT5 (P2_UUT5.2), CTL5 (R1_CTL5.2)
TEST6: UUT6 (P2_UUT6.2), CTL6 (R1_CTL6.2)
TEST7: UUT7 (P2_UUT7.2), CTL7 (R1_CTL7.2)
TEST8: UUT8 (P2_UUT8.2), CTL8 (R1_CTL8.2)
TEST9: UUT9 (P2_UUT9.2), CTL9 (R1_CTL9.2)
TEST10: UUT10 (P2_UUT10.2), CTL10 (R1_CTL10.2)
TEST11: UUT11 (P2_UUT11.2), CTL11 (R1_CTL11.2)
TEST12: UUT12 (P2_UUT12.2), CTL12 (R1_CTL12.2)
TEST13: UUT13 (P2_UUT13.2), CTL13 (R1_CTL13.2)
TEST14: UUT14 (P2_UUT14.2), CTL14 (R1_CTL14.2)
TEST15: UUT15 (P2_UUT15.2), CTL15 (R1_CTL15.2)
TEST16: UUT16 (P2_UUT16.2), CTL16 (R1_CTL16.2)
TEST17: UUT17 (P2_UUT17.2), CTL17 (R1_CTL17.2)
TEST18: UUT18 (P2_UUT18.2), CTL18 (R1_CTL18.2)
TEST19: UUT19 (P2_UUT19.2), CTL19 (R1_CTL19.2)
TEST20: UUT20 (P2_UUT20.2), CTL20 (R1_CTL20.2)
TEST21: UUT21 (P2_UUT21.2), CTL21 (R1_CTL21.2)
TEST22: UUT22 (P2_UUT22.2), CTL22 (R1_CTL22.2)
TEST23: UUT23 (P2_UUT23.2), CTL23 (R1_CTL23.2)
TEST24: UUT24 (P2_UUT24.2), CTL24 (R1_CTL24.2)
TEST25: UUT25 (P2_UUT25.2), CTL25 (R1_CTL25.2)
TEST26: UUT26 (P2_UUT26.2), CTL26 (R1_CTL26.2)
TEST27: UUT27 (P2_UUT27.2), CTL27 (R1_CTL27.2)
TEST28: UUT28 (P2_UUT28.2), CTL28 (R1_CTL28.2)
TEST29: UUT29 (P2_UUT29.2), CTL29 (R1_CTL29.2)
TEST30: UUT30 (P2_UUT30.2), CTL30 (R1_CTL30.2)
TEST31: UUT31 (P2_UUT31.2), CTL31 (R1_CTL31.2)
TEST32: UUT32 (P2_UUT32.2), CTL32 (R1_CTL32.2)
TEST33: UUT33 (P2_UUT33.2), CTL33 (R1_CTL33.2)
TEST34: UUT34 (P2_UUT34.2), CTL34 (R1_CTL34.2)
TEST35: UUT35 (P2_UUT35.2), CTL35 (R1_CTL35.2)
TEST36: UUT36 (P2_UUT36.2), CTL36 (R1_CTL36.2)
TEST37: UUT37 (P2_UUT37.2), CTL37 (R1_CTL37.2)
TEST38: UUT38 (P2_UUT38.2), CTL38 (R1_CTL38.2)
TEST39: UUT39 (P2_UUT39.2), CTL39 (R1_CTL39.2)
TEST40: UUT40 (P2_UUT40.2), CTL40 (R1_CTL40.2)
TEST41: UUT41 (P2_UUT41.2), CTL41 (R1_CTL41.2)
TEST42: UUT42 (P2_UUT42.2), CTL42 (R1_CTL42.2)
TEST43: UUT43 (P2_UUT43.2), CTL43 (R1_CTL43.2)
TEST44: UUT44 (P2_UUT44.2), CTL44 (R1_CTL44.2)
TEST45: UUT45 (P2_UUT45.2), CTL45 (R1_CTL45.2)
TEST46: UUT46 (P2_UUT46.2), CTL46 (R1_CTL46.2)
TEST47: UUT47 (P2_UUT47.2), CTL47 (R1_CTL47.2)
TEST48: UUT48 (P2_UUT48.2), CTL48 (R1_CTL48.2)
TEST49: UUT49 (P2_UUT49.2), CTL49 (R1_CTL49.2)
TEST50: UUT50 (P2_UUT50.2), CTL50 (R1_CTL50.2)
TEST51: UUT51 (P2_UUT51.2), CTL51 (R1_CTL51.2)
TEST52: UUT52 (P2_UUT52.2), CTL52 (R1_CTL52.2)
TEST53: UUT53 (P2_UUT53.2), CTL53 (R1_CTL53.2)
TEST54: UUT54 (P2_UUT54.2), CTL54 (R1_CTL54.2)
VCC: UUT1 (C2_UUT1.1 P1_UUT1.1 U3_UUT1.5), CTL1 (5 pins)
VCC: UUT2 (C2_UUT2.1 P1_UUT2.1 U3_UUT2.5), CTL2 (5 pins)
VCC: UUT3 (C2_UUT3.1 P1_UUT3.1 U3_UUT3.5), CTL3 (5 pins)
VCC: UUT4 (C2_UUT4.1 P1_UUT4.1 U3_UUT4.5), CTL4 (5 pins)
VCC: UUT5 (C2_UUT5.1 P1_UUT5.1 U3_UUT5.5), CTL5 (5 pins)
VCC: UUT6 (C2_UUT6.1 P1_UUT6.1 U3_UUT6.5), CTL6 (5 pins)
VCC: UUT7 (C2_UUT7.1 P1_UUT7.1 U3_UUT7.5), CTL7 (5 pins)
VCC: UUT8 (C2_UUT8.1 P1_UUT8.1 U3_UUT8.5), CTL8 (5 pins)
VCC: UUT9 (C2_UUT9.1 P1_UUT9.1 U3_UUT9.5), CTL9 (5 pins)
VCC: UUT10 (C2_UUT10.1 P1_UUT10.1 U3_UUT10.5), CTL10 (5 pins)
VCC: UUT11 (C2_UUT11.1 P1_UUT11.1 U3_UUT11.5), CTL11 (5 pins)
VCC: UUT12 (C2_UUT12.1 P1_UUT12.1 U3_UUT12.5), CTL12 (5 pins)
VCC: UUT13 (C2_UUT13.1 P1_UUT13.1 U3_UUT13.5), CTL13 (5 pins)
VCC: UUT14 (C2_UUT14.1 P1_UUT14.1 U3_UUT14.5), CTL14 (5 pins)
VCC: UUT15 (C2_UUT15.1 P1_UUT15.1 U3_UUT15.5), CTL15 (5 pins)
VCC: UUT16 (C2_UUT16.1 P1_UUT16.1 U3_UUT16.5), CTL16 (5 pins)
VCC: UUT17 (C2_UUT17.1 P1_UUT17.1 U3_UUT17.5), CTL17 (5 pins)
VCC: UUT18 (C2_UUT18.1 P1_UUT18.1 U3_UUT18.5), CTL18 (5 pins)
VCC: UUT19 (C2_UUT19.1 P1_UUT19.1 U3_UUT19.5), CTL19 (5 pins)
VCC: UUT20 (C2_UUT20.1 P1_UUT20.1 U3_UUT20.5), CTL20 (5 pins)
VCC: UUT21 (C2_UUT21.1 P1_UUT21.1 U3_UUT21.5), CTL21 (5 pins)
VCC: UUT22 (C2_UUT22.1 P1_UUT22.1 U3_UUT22.5), CTL22 (5 pins)
VCC: UUT23 (C2_UUT23.1 P1_UUT23.1 U3_UUT23.5), CTL23 (5 pins)
VCC: UUT24 (C2_UUT24.1 P1_UUT24.1 U3_UUT24.5), CTL24 (5 pins)
VCC: UUT25 (C2_UUT25.1 P1_UUT25.1 U3_UUT25.5), CTL25 (5 pins)
VCC: UUT26 (C2_UUT26.1 P1_UUT26.1 U3_UUT26.5), CTL26 (5 pins)
VCC: UUT27 (C2_UUT27.1 P1_UUT27.1 U3_UUT27.5), CTL27 (5 pins)
VCC: UUT28 (C2_UUT28.1 P1_UUT28.1 U3_UUT28.5), CTL28 (5 pins)
VCC: UUT29 (C2_UUT29.1 P1_UUT29.1 U3_UUT29.5), CTL29 (5 pins)
VCC: UUT30 (C2_UUT30.1 P1_UUT30.1 U3_UUT30.5), CTL30 (5 pins)
VCC: UUT31 (C2_UUT31.1 P1_UUT31.1 U3_UUT31.5), CTL31 (5 pins)
VCC: UUT32 (C2_UUT32.1 P1_UUT32.1 U3_UUT32.5), CTL32 (5 pins)
VCC: UUT33 (C2_UUT33.1 P1_UUT33.1 U3_UUT33.5), CTL33 (5 pins)
VCC: UUT34 (C2_UUT34.1 P1_UUT34.1 U3_UUT34.5), CTL34 (5 pins)
VCC: UUT35 (C2_UUT35.1 P1_UUT35.1 U3_UUT35.5), CTL35 (5 pins)
VCC: UUT36 (C2_UUT36.1 P1_UUT36.1 U3_UUT36.5), CTL36 (5 pins)
VCC: UUT37 (C2_UUT37.1 P1_UUT37.1 U3_UUT37.5), CTL37 (5 pins)
VCC: UUT38 (C2_UUT38.1 P1_UUT38.1 U3_UUT38.5), CTL38 (5 pins)
VCC: UUT39 (C2_UUT39.1 P1_UUT39.1 U3_UUT39.5), CTL39 (5 pins)
VCC: UUT40 (C2_UUT40.1 P1_UUT40.1 U3_UUT40.5), CTL40 (5 pins)
VCC: UUT41 (C2_UUT41.1 P1_UUT41.1 U3_UUT41.5), CTL41 (5 pins)
VCC: UUT42 (C2_UUT42.1 P1_UUT42.1 U3_UUT42.5), CTL42 (5 pins)
VCC: UUT43 (C2_UUT43.1 P1_UUT43.1 U3_UUT43.5), CTL43 (5 pins)
VCC: UUT44 (C2_UUT44.1 P1_UUT44.1 U3_UUT44.5), CTL44 (5 pins)
VCC: UUT45 (C2_UUT45.1 P1_UUT45.1 U3_UUT45.5), CTL45 (5 pins)
VCC: UUT46 (C2_UUT46.1 P1_UUT46.1 U3_UUT46.5), CTL46 (5 pins)
VCC: UUT47 (C2_UUT47.1 P1_UUT47.1 U3_UUT47.5), CTL47 (5 pins)
VCC: UUT48 (C2_UUT48.1 P1_UUT48.1 U3_UUT48.5), CTL48 (5 pins)
VCC: UUT49 (C2_UUT49.1 P1_UUT49.1 U3_UUT49.5), CTL49 (5 pins)
VCC: UUT50 (C2_UUT50.1 P1_UUT50.1 U3_UUT50.5), CTL50 (5 pins)
VCC: UUT51 (C2_UUT51.1 P1_UUT51.1 U3_UUT51.5), CTL51 (5 pins)
VCC: UUT52 (C2_UUT52.1 P1_UUT52.1 U3_UUT52.5), CTL52 (5 pins)
VCC: UUT53 (C2_UUT53.1 P1_UUT53.1 U3_UUT53.5), CTL53 (5 pins)
VCC: UUT54 (C2_UUT54.1 P1_UUT54.1 U3_UUT54.5), CTL54 (5 pins)